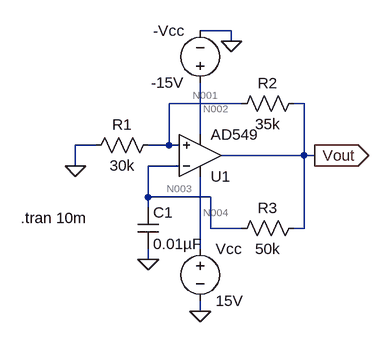
[diagram p0: schematic Q2.asc]
Q2.asc, the LTspice schematic file:
Version 4
SHEET 1 880 680
WIRE 272 -48 224 -48
WIRE 272 -32 272 -48
WIRE 288 64 176 64
WIRE 384 64 368 64
WIRE 224 112 224 32
WIRE 64 128 32 128
WIRE 176 128 176 64
WIRE 176 128 144 128
WIRE 192 128 176 128
WIRE 384 144 384 64
WIRE 384 144 256 144
WIRE 400 144 384 144
WIRE 32 160 32 128
WIRE 192 160 144 160
WIRE 144 208 144 160
WIRE 240 208 144 208
WIRE 144 224 144 208
WIRE 240 256 240 208
WIRE 288 256 240 256
WIRE 384 256 384 144
WIRE 384 256 368 256
WIRE 224 288 224 176
WIRE 144 304 144 288
WIRE 224 384 224 368
FLAG 32 160 0
FLAG 144 304 0
FLAG 400 144 Vout
IOPIN 400 144 Out
FLAG 224 384 0
FLAG 272 -32 0
SYMBOL res 160 112 R90
WINDOW 0 0 56 VBottom 2
WINDOW 3 32 56 VTop 2
SYMATTR InstName R1
SYMATTR Value 30k
SYMBOL res 384 48 R90
WINDOW 0 0 56 VBottom 2
WINDOW 3 32 56 VTop 2
SYMATTR InstName R2
SYMATTR Value 35k
SYMBOL res 384 240 R90
WINDOW 0 0 56 VBottom 2
WINDOW 3 32 56 VTop 2
SYMATTR InstName R3
SYMATTR Value 50k
SYMBOL cap 128 224 R0
SYMATTR InstName C1
SYMATTR Value 0.01µF
SYMBOL voltage 224 272 R0
SYMATTR InstName Vcc
SYMATTR Value 15V
SYMBOL voltage 224 48 R180
WINDOW 0 24 96 Left 2
WINDOW 3 24 16 Left 2
SYMATTR InstName -Vcc
SYMATTR Value -15V
SYMBOL Opamps\\AD549 224 208 M180
SYMATTR InstName U1
TEXT -52 240 Left 2 !.tran 10m

The netlist it stands for:
* Q2.asc
R1 N001 0 30k
R2 Vout N001 35k
R3 Vout N003 50k
C1 N003 0 0.01µF
Vcc N004 0 15V
V§-Vcc N002 0 -15V
XU1 N001 N003 N004 N002 Vout AD549  ; pins In+ In- V+ V- OUT
.tran 10m
.backanno
.end

* Results of the author's LTspice run, read from the files saved beside the schematic
* Operating Point, zero values left out:
*   V(n001) = -307.7 nV
*   V(vout) = -666.6 nV
*   V(n003) = -666.6 nV
*   V(n004) = 15 V
*   V(n002) = -15 V
*   I(R2) = -10.26 pA
*   I(R1) = -10.26 pA
*   I(-vcc) = 794.4 µA
*   I(Vcc) = -794.4 µA
*   Ix(u1:3) = 794.4 µA
*   Ix(u1:4) = -794.4 µA
*   Ix(u1:5) = 10.26 pA
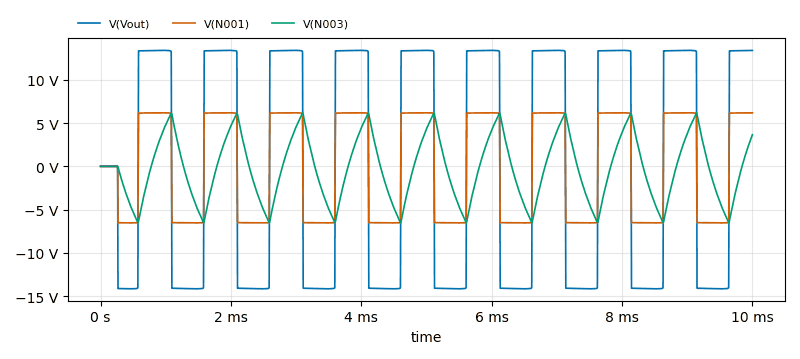
[diagram p1: Transient Analysis of Q2.asc, plotted from the saved traces]
* Transient Analysis, 1 run:
*   V(Vout): min -14.15 V, max 13.41 V, average -88.24 mV, rms 13.49 V, last 13.4 V
*   V(N001): min -6.533 V, max 6.189 V, average -40.73 mV, rms 6.227 V, last 6.185 V
*   V(N003): min -6.518 V, max 6.17 V, average -270.5 mV, rms 3.799 V, last 3.652 V